# EasyEDA Pro project ProPrj_usb转串口_2025-12-14-12-24-50.epro

# Schematic Schematic1
Board Name: Board1; Create Date: 2025-12-06; Page Name: P1; Project Name: usb转串口; Schematic Name: Schematic1; Update Date: 2025-12-06; Company: 嘉立创EDA; Page Size: A4; Version: V1.0
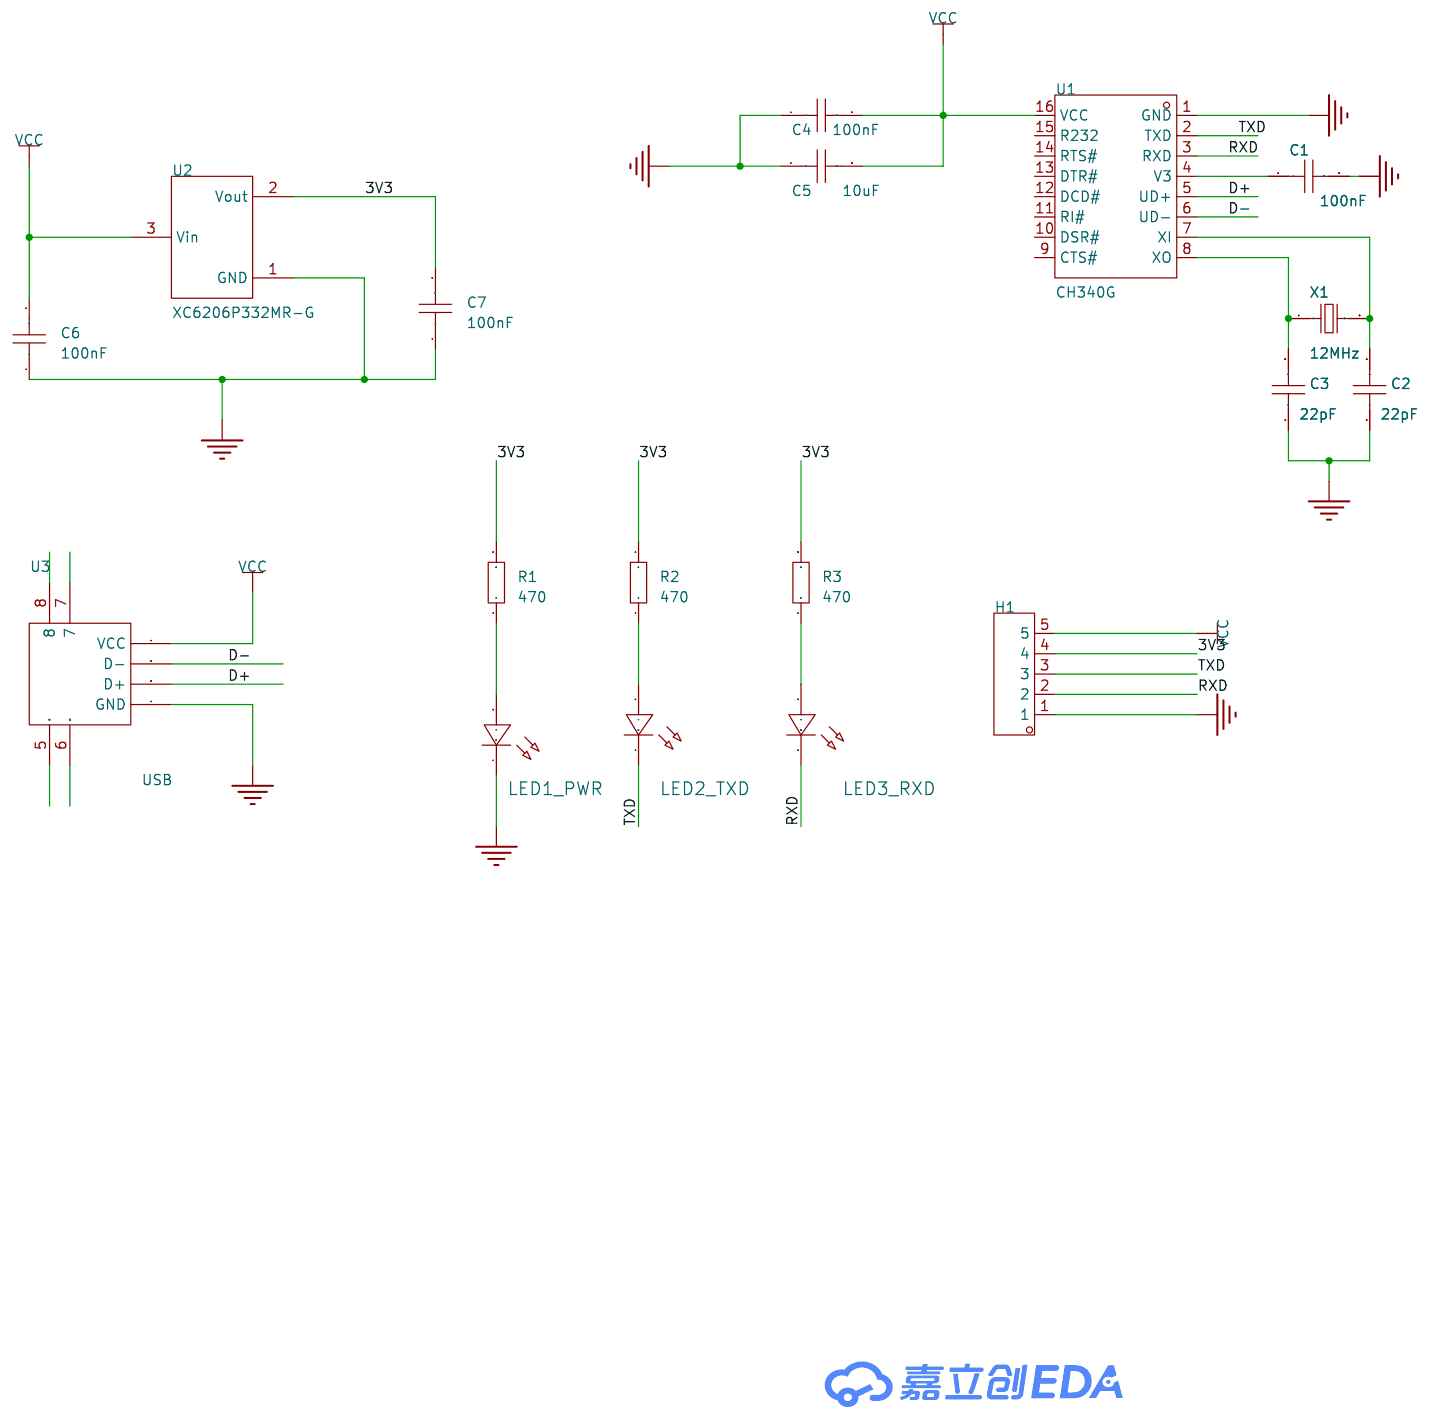
[diagram p0: schematic sheet]

## Parts
C1  100nF  [C0603]
C2  22pF  [C0603]
C3  22pF  [C0603]
C4  100nF  [C0603]
C5  10uF  [C0603]
C6  100nF  [C0603]
C7  100nF  [C0603]
H1  -  [HDR-TH_5P-P2.54-V-M]
LED1_PWR  -  [LED_0603]
LED2_TXD  -  [LED_0603]
LED3_RXD  -  [LED_0603]
R1  470  [R0603]
R2  470  [R0603]
R3  470  [R0603]
U1  CH340G  [SOIC-16_L9.9-W3.9-P1.27-LS6.0-BL]
U2  XC6206P332MR-G  [SOT-23-3_L2.9-W1.6-P1.90-LS2.8-BR]
U3  USB  [USB-SMD_USB_1]
X1  12MHz  [CRYSTAL-SMD_L5.0-W3.2]

## Library data of the parts
C1-C7 = CAP_0603: Supplier Footprint: 0603
H1 = HDR-M_2.54_1x5P: Supplier Part: C358687; Supplier Footprint: 插件
LED1_PWR LED2_TXD LED3_RXD = LED_0603-R: Supplier Footprint: 0603
R1-R3 = Res_0603: Supplier Footprint: 0603
U1 = CH340G: 应用功能:USB转UART;接口协议:USB 2.0;数据速率:2Mbps;; LCSC Part Name: USB转串口芯片CH340; Supplier Part: C14267; Manufacturer: WCH(南京沁恒); Supplier Footprint: SOP-16; JLCPCB Part Class: 扩展库; Datasheet: https://atta.szlcsc.com/upload/public/pdf/source/20240313/8510303D24D987FBF1AD30058571F10E.pdf; Supplier: LCSC; Applications Function: USB转UART; Protocol: USB 2.0; Supply Voltage: 5V；3.3V; Data Rate: 2Mbps; Operating Temperature: -40℃~+85℃
U2 = XC6206P332MR-G_C5446: 输出类型:固定;工作电压:6V;输出电压:3.3V;输出电流:200mA;电源纹波抑制比(PSRR):-;输出极性:正极;; LCSC Part Name: 输入6V 输出3.3V 200mA; Supplier Part: C5446; Manufacturer: TOREX(特瑞仕); Supplier Footprint: SOT-23-3L; JLCPCB Part Class: 基础库; Datasheet: https://item.szlcsc.com/datasheet/XC6206P332MR-G/5896.html; Supplier: LCSC; Output Type: 固定; Voltage - Supply: 6V; Output Voltage: 3.3V; Output Current: 200mA; standby current: 1uA; Features: 过流保护; Operating Temperature: -40℃~+85℃@(Ta); Output Configuration: 正极; Number of Outputs: 1
U3 = USB: Supplier Part: C9900237861; Supplier Footprint: SMD; JLCPCB Part Class: 扩展库; Supplier: LCSC
X1 = XC53G2-12.000-F20LJDT: 晶振类型:贴片晶振;频率:12MHz;常温频差:±20ppm;负载电容:20pF;频率稳定度:±30ppm;; LCSC Part Name: 12MHz ±20ppm 20pF; Supplier Part: C2842275; Manufacturer: HCI(杭晶); Supplier Footprint: SMD5032-2P; JLCPCB Part Class: 扩展库; Datasheet: https://item.szlcsc.com/datasheet/XC53G2-12.000-F20LJDT/3026549.html; Supplier: LCSC; Type: 贴片晶振; Normal temperature Frequency Tolerance: ±20ppm; Load Capacitance: 20pF; Frequency Stability: ±30ppm; Equivalent Series Resistance(ESR): 80Ω; Operating Temperature: -40℃~+85℃

## Nets
3V3: C7.2 H1.4 R1.2 R2.2 R3.2 U2.2(Vout)
GND: C1.2 C2.1 C3.1 C4.1 C5.1 C6.1 C7.1 H1.1 LED1_PWR.1(C) U1.1(GND) U2.1(GND) U3.4(GND)
VCC: C4.2 C5.2 C6.2 H1.5 U1.16(VCC) U2.3(Vin) U3.1(VCC)
D+: U1.5(UD+) U3.3(D+)
D-: U1.6(UD-) U3.2(D-)
RXD: H1.2 LED3_RXD.1(C) U1.3(RXD)
TXD: H1.3 LED2_TXD.1(C) U1.2(TXD)
$1N320: C1.1 U1.4(V3)
$1N529: C3.2 U1.8(XO) X1.1
$1N534: C2.2 U1.7(XI) X1.2
$1N1763: LED1_PWR.2(A) R1.1
$1N1767: LED2_TXD.2(A) R2.1
$1N1772: LED3_RXD.2(A) R3.1

Not connected (* = marked no-connect by the designer): U1 9(CTS#) 10(DSR#) 11(RI#) 12(DCD#) 13(DTR#) 14(RTS#) 15(R232); U3 5(SH1) 6(SH2) 7 8

# Board PCB1
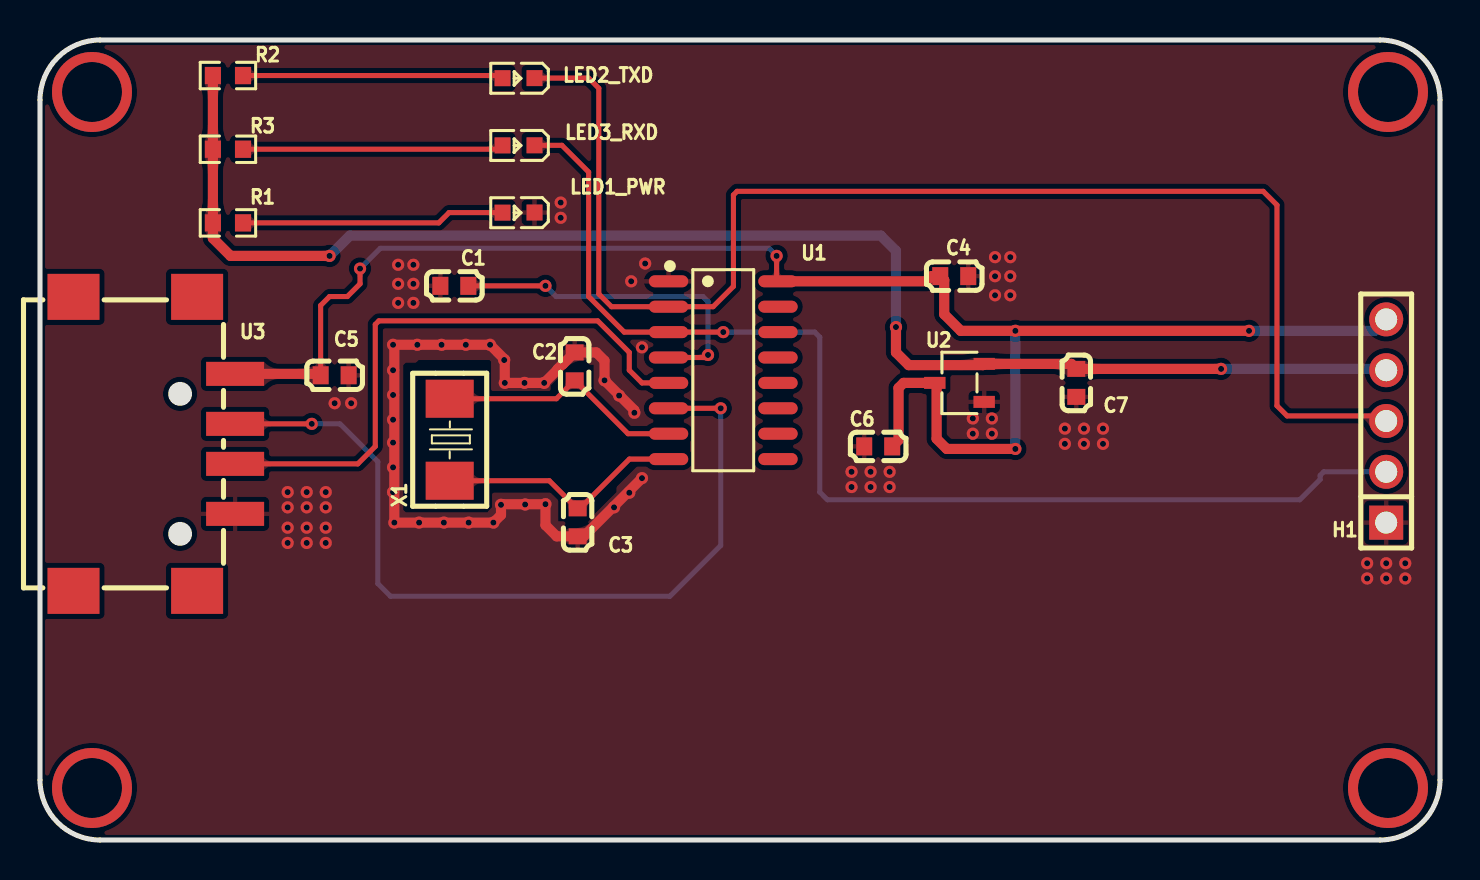
[diagram p1: board, top side]
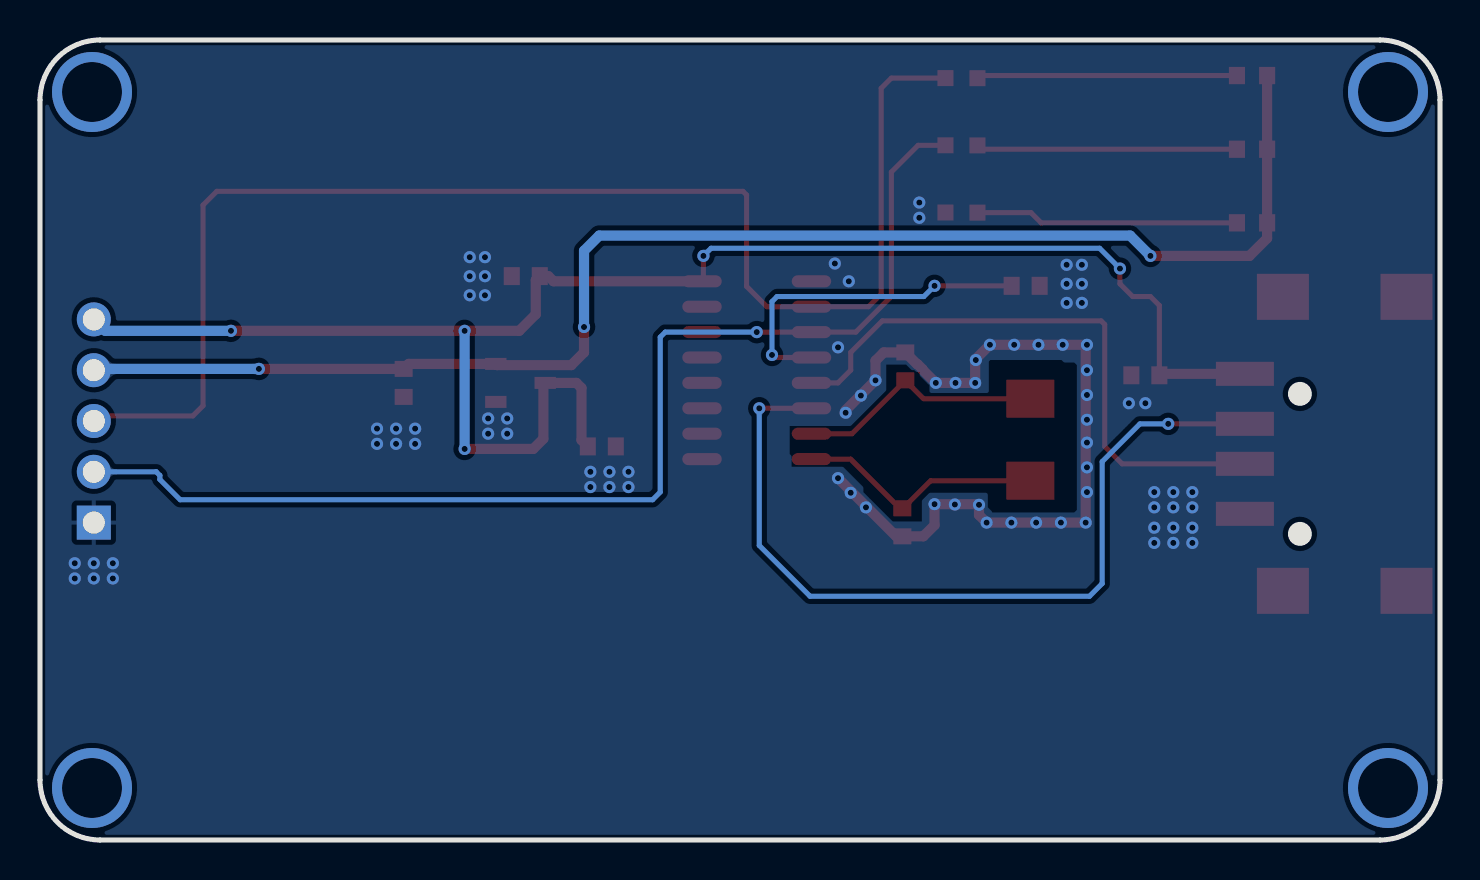
[diagram p2: board, bottom side, seen from below]

Outline 70 x 40 mm; copper layers: Top Layer, Bottom Layer. Coordinates in mm from the lower left corner of the outline.
Outline path: 0,37 0,3 arc(0.88,0.88) 3,0 67,0 arc(69.12,0.88) 70,3 70,37 arc(69.12,39.12) 67,40 3,40 arc(0.88,39.12) 0,37
Stack: Top Layer 0.035mm / Dielectric1 1.51mm FR4 er 4.5 / Bottom Layer 0.035mm

## Design rules (mm)
net $1N534: DP1
net $1N529: DP1
template: JLCPCB Capability(Two Layers Board)
spacing copperThickness1oz (default): track to track 0.102, other pairs 0.152 to 0.3
spacing copperThickness2oz: track to track 0.203, other pairs 0.152 to 0.3
track width copperThickness1oz (default): min 0.127, default 0.254, max 2.54
track width copperThickness2oz: min 0.203, default 0.254, max 2.54
differential pair differentialPair (default): width min 0.127, default 0.254, max 2.54; gap min 0.152, default 0.152
via viaSize (default): diameter min 0.5, default 0.61, max 10; hole min 0.3, default 0.305, max 6.3

## Placement (name value [footprint] x y rotation side)
C1  100nF  [C0603]  20.72 27.71 180 top
C2  22pF  [C0603]  26.74 23.68 270 top
C3  22pF  [C0603]  26.88 15.88 90 top
C4  100nF  [C0603]  45.71 28.19 180 top
C5  10uF  [C0603]  14.73 23.24 180 top
C6  100nF  [C0603]  41.91 19.68 0 top
C7  100nF  [C0603]  51.82 22.86 90 top
H1  -  [HDR-TH_5P-P2.54-V-M]  67.31 20.95 90 top
LED1_PWR  -  [LED_0603]  23.88 31.36 180 top
LED2_TXD  -  [LED_0603]  23.88 38.08 180 top
LED3_RXD  -  [LED_0603]  23.88 34.72 180 top
R1  470  [R0603]  9.4 30.86 180 top
R2  470  [R0603]  9.4 38.22 180 top
R3  470  [R0603]  9.4 34.54 180 top
U1  CH340G  [SOIC-16_L9.9-W3.9-P1.27-LS6.0-BL]  34.16 23.49 270 top
U2  XC6206P332MR-G  [SOT-23-3_L2.9-W1.6-P1.90-LS2.8-BR]  45.97 22.86 0 top
U3  USB  [USB-SMD_USB_1]  5.72 19.81 270 top
X1  12MHz  [CRYSTAL-SMD_L5.0-W3.2]  20.48 20.01 90 top

## Footprints (pads in the part's own frame, mm; a bottom-side part is the same pattern mirrored in y, then rotated)
C0603
  rect 0.8x0.9 smd: 1(-0.7,0) 2(0.7,0)
CRYSTAL-SMD_L5.0-W3.2
  rect 1.9x2.4 smd: 1(-2.05,0) 2(2.05,0)
HDR-TH_5P-P2.54-V-M
  rect 1.7x1.7 hole 1.1: 1(-5.08,0)
  round 1.7 hole 1.1: 2(-2.54,0) 3(0,0) 4(2.54,0) 5(5.08,0)
LED_0603
  rect 0.8x0.8 smd: 1(-0.851,-0.01) 2(0.75,-0.005)
R0603
  rect 0.806x0.864 smd: 1(-0.753,0) 2(0.753,0)
SOIC-16_L9.9-W3.9-P1.27-LS6.0-BL
  oval 0.602x1.971 smd: 1(-4.445,-2.736) 2(-3.175,-2.736) 3(-1.905,-2.736) 4(-0.635,-2.736) 5(0.635,-2.736) 6(1.905,-2.736) 7(3.175,-2.736) 8(4.445,-2.736) 9(4.445,2.736) 10(3.175,2.736) 11(1.905,2.736) 12(0.635,2.736) 13(-0.635,2.736) 14(-1.905,2.736) 15(-3.175,2.736) 16(-4.445,2.736)
SOT-23-3_L2.9-W1.6-P1.90-LS2.8-BR
  rect 1.07x0.6 smd: 1(1.235,-0.95) 2(1.235,0.95) 3(-1.235,0)
USB-SMD_USB_1
  rect 1.2x2.9 smd: 1(-3.5,4.04) 2(-1,4.04) 3(1,4.04) 4(3.5,4.04)
  rect 2.3x2.6 smd: 5(7.35,2.14) 6(7.35,-4.04) 7(-7.35,-4.04) 8(-7.35,2.14)

## Nets
As in the schematic.

Pads without a net: U1 9 10 11 12 13 14 15

## Via types
v1: diameter 4, hole 3, Top Layer to Bottom Layer, 4 vias
v2: diameter 0.61, hole 0.305, Top Layer to Bottom Layer, 95 vias

## Routing (per net, layer and track width the routed paths; a pad name or vN(x,y) marks a point on that pad's centre or on a via; arc(x,y) is an arc through that point)
3V3: length 73.4
  Top Layer w0.508: v2(14.48,29.2) 9.53,29.2 8.64,30.09 R1.2 R3.2 R2.2 ; v2(59.06,23.56) C7.2 51.57,23.81 U2.2 47.15,23.74 43.43,23.74 42.8,24.38 v2(42.8,25.65)
  Bottom Layer w0.508: v2(59.06,23.56) 67.25,23.56 H1.4 ; v2(14.48,29.2) 15.49,30.22 42.04,30.22 42.8,29.46 v2(42.8,25.65)
GND: length 40.5
  Top Layer w0.508: v2(30.1,18.09) 27.19,15.18 C3.1 25.83,15.18 25.27,15.74 v2(25.27,16.79) 23.08,16.79 v2(23.05,16.76) 23.05,16.25 v2(22.67,15.87) v2(21.43,15.87) v2(20.19,15.87) v2(18.96,15.87) v2(17.72,15.87) 17.72,24.7 v2(17.65,24.76) v2(18.87,24.76) v2(20.08,24.76) v2(21.29,24.76) v2(22.5,24.76) 23.24,24.02 v2(23.24,22.86) v2(24.23,22.86) 25.21,22.86 25.88,23.52 25.88,23.55 26.12,23.78 26.14,23.78 C2.1 27.81,24.38 28.23,23.97 v2(28.23,22.98) 29.72,21.49 v2(29.72,21.36)
  vias: v2(12.38,17.39) v2(12.38,16.63) v2(12.38,15.62) v2(12.38,14.85) v2(13.33,17.39) v2(13.33,16.63) v2(13.33,15.62) v2(13.33,14.85) v2(14.29,17.39) v2(14.29,16.63) v2(14.29,15.62) v2(14.29,14.85) v2(14.73,21.84) v2(15.56,21.84) v2(17.65,23.49) v2(17.65,22.25) v2(17.65,21.01) v2(17.65,19.87) v2(17.65,18.63) v2(17.65,17.39) v2(17.91,28.76) v2(17.91,27.81) v2(17.91,26.86) v2(18.67,28.76) v2(18.67,27.81) v2(18.67,26.86) v2(23.21,24) v2(24.26,16.78) v2(25.21,22.86) v2(26.03,31.87) v2(26.03,31.11) v2(28.7,16.63) v2(28.96,22.22) v2(29.46,17.36) v2(29.56,27.94) v2(30.1,24.63) v2(30.26,28.82) v2(40.58,18.41) v2(40.58,17.65) v2(41.53,18.41) v2(41.53,17.65) v2(42.48,18.41) v2(42.48,17.65) v2(46.64,21.08) v2(46.64,20.31) v2(47.59,21.08) v2(47.59,20.31) v2(47.75,29.14) v2(47.75,28.19) v2(47.75,27.24) v2(48.51,29.14) v2(48.51,28.19) v2(48.51,27.24) v2(51.24,20.57) v2(51.24,19.81) v2(52.2,20.57) v2(52.2,19.81) v2(53.15,20.57) v2(53.15,19.81) v2(66.36,13.84) v2(66.36,13.08) v2(67.31,13.84) v2(67.31,13.08) v2(68.26,13.84) v2(68.26,13.08)
VCC: length 84.4
  Top Layer w0.254: v2(36.83,29.2) 36.83,28 U1.16 ; v2(16,28.57) 16,27.81 15.37,27.17 14.48,27.17 14.03,26.73 C5.2
  Top Layer w0.508: U1.16 44.32,27.94 44.58,28.19 C4.2 45.21,27.99 45.21,26.28 46.04,25.46 v2(48.77,25.46) v2(60.45,25.46) ; C6.2 42.93,20 42.93,22.6 43.18,22.86 44.74,22.86 44.83,22.76 44.83,20.06 45.34,19.55 v2(48.77,19.55) ; U3.1 13.96,23.31 C5.2
  Bottom Layer w0.254: v2(16,28.57) 17.02,29.59 36.45,29.59 v2(36.83,29.2)
  Bottom Layer w0.508: v2(60.45,25.46) 66.74,25.46 H1.5 ; v2(48.77,25.46) v2(48.77,19.55)
(no net):
  vias: v1(2.6,37.4) v1(2.6,2.6) v1(67.4,37.4) v1(67.4,2.6)
D+: length 30
  Top Layer w0.254: 31.43,22.86 30.1,22.86 29.46,23.49 29.46,24.38 27.89,25.96 16.94,25.96 16.76,25.78 16.76,19.68 15.89,18.81 U3.3
D-: length 41.9
  Top Layer w0.254: U3.2 v2(13.59,20.81) ; v2(34.04,21.58) U1.6
  Bottom Layer w0.254: v2(34.04,21.58) 34.04,14.73 31.5,12.19 17.53,12.19 16.89,12.82 16.89,18.92 15,20.81 v2(13.59,20.81)
RXD: length 58.8
  Top Layer w0.254: v2(34.16,25.39) U1.3 29.21,25.39 27.43,27.17 27.43,33.4 26.09,34.73 LED3_RXD.1
  Bottom Layer w0.254: v2(34.16,25.39) 38.74,25.39 38.99,25.14 38.99,17.39 39.37,17.01 62.99,17.01 64.01,18.03 64.01,18.23 64.19,18.41 H1.2
TXD: length 69
  Top Layer w0.254: H1.3 67.06,21.2 62.36,21.2 61.85,21.71 61.85,31.75 61.16,32.43 34.85,32.43 34.67,32.25 34.67,27.68 33.66,26.67 U1.2 28.57,26.67 27.94,27.3 27.94,37.59 27.43,38.09 LED2_TXD.1
$1N320: length 17
  Top Layer w0.254: C1.1 v2(25.27,27.71) ; U1.4 33.27,24.12 v2(33.4,24.25)
  Bottom Layer w0.254: v2(33.4,24.25) 33.4,26.92 33.15,27.17 25.81,27.17 v2(25.27,27.71)
$1N529: length 12.5
  Top Layer w0.254: X1.1 25.47,17.96 26.75,16.68 27.11,16.68 29.47,19.05 U1.8
$1N534: length 12.4
  Top Layer w0.254: X1.2 25.82,22.06 C2.2 29.4,20.31 U1.7
$1N1763: length 13.2
  Top Layer w0.254: R1.1 19.94,30.86 20.45,31.37 LED1_PWR.2
$1N1767: length 13
  Top Layer w0.254: LED2_TXD.2 22.99,38.22 R2.1
$1N1772: length 13.1
  Top Layer w0.254: R3.1 22.94,34.54 LED3_RXD.2

## Copper pours and planes (outline as drawn; the poured copper is in the pictures)
GND on Top Layer: -5.72,41.91 76.96,41.91 76.96,-7.88 -5.72,-7.88
GND on Top Layer: -2.92,42.16 71.88,42.16 71.88,-5.09 -2.92,-5.09
GND on Bottom Layer: -5.59,44.83 87.63,44.83 87.63,-10.42 -5.59,-10.42

Small or netless copper shapes (teardrops, artwork), in the pictures only: 109 on Top Layer, 9 on Bottom Layer
